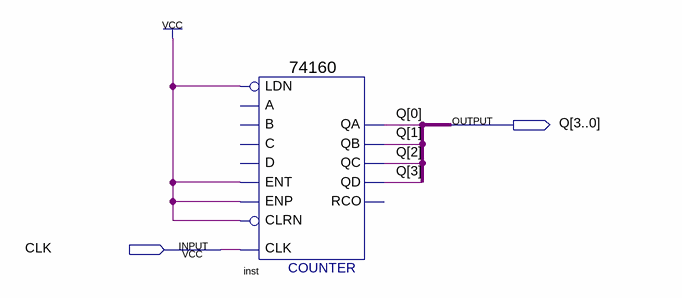
[diagram p0: schematic sheet]
// Quartus schematic Ten_Counter.bdf as structural Verilog: 1 symbols, 2 pins
module Ten_Counter (
  input  CLK,
  output [3:0] Q
);

  \74160  inst (
    .CLK(CLK), .ENT(1'b1), .LDN(1'b1), .ENP(1'b1), .CLRN(1'b1), .QD(Q[3]), .QA(Q[0]), .QB(Q[1]), .QC(Q[2]));  // open: A, B, C, D, RCO
endmodule
